# EAGLE design Adapter-TenX-Resistors (EAGLE 7.7.0)
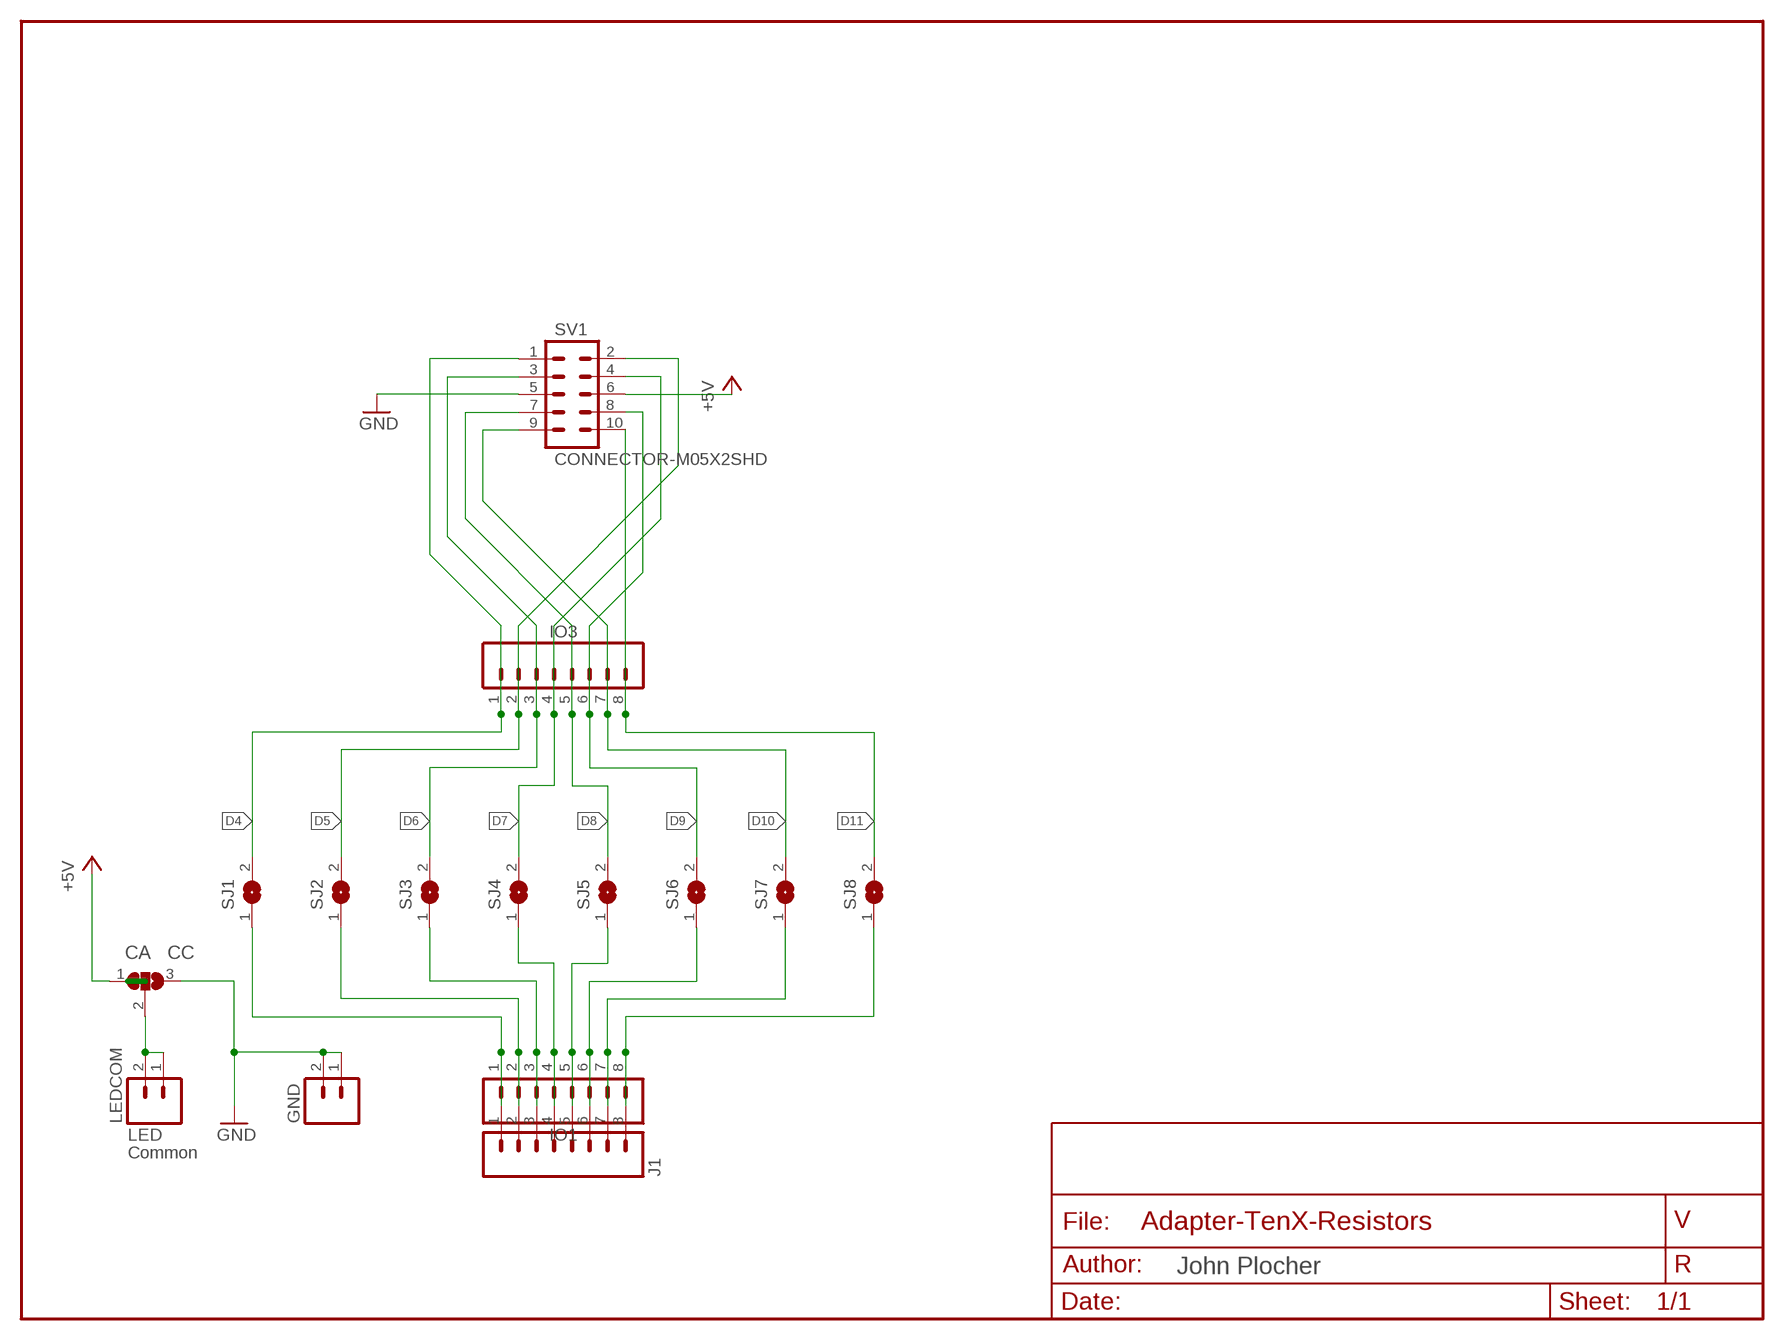
[diagram p0: schematic, sheet 1]

## Parts
GND  M02POLAR_LOCK  [MOLEX-1X2_LOCK]
IO1  M081X08  [1X08]
IO3  M081X08  [1X08]
J1  CONNECTOR-M08LOCK_LONGPADS  [1X08_LOCK_LONGPADS]
LEDCOM  M02POLAR_LOCK  [MOLEX-1X2_LOCK]
P1  CA CC  PAD-SOLDERJUMPER-2WAYT  [3P-SMD-2X4.8]
SJ1  SJ  [SJ]
SJ2  SJ  [SJ]
SJ3  SJ  [SJ]
SJ4  SJ  [SJ]
SJ5  SJ  [SJ]
SJ6  SJ  [SJ]
SJ7  SJ  [SJ]
SJ8  SJ  [SJ]
SV1  CONNECTOR-M05X2SHD  [2X5-SHROUDED]

## Nets
+5V: P1.1 SV1.6
D4: IO3.1 SJ1.2 SV1.1
D5: IO3.2 SJ2.2 SV1.2
D6: IO3.3 SJ3.2 SV1.3
D7: IO3.4 SJ4.2 SV1.4
D8: IO3.5 SJ5.2 SV1.7
D9: IO3.6 SJ6.2 SV1.8
D10: IO3.7 SJ7.2 SV1.9
D11: IO3.8 SJ8.2 SV1.10
GND: GND.1 GND.2 P1.3 SV1.5
N$9: IO1.1 J1.1 SJ1.1
N$10: IO1.2 J1.2 SJ2.1
N$11: IO1.3 J1.3 SJ3.1
N$12: IO1.4 J1.4 SJ4.1
N$13: IO1.5 J1.5 SJ5.1
N$14: IO1.6 J1.6 SJ6.1
N$15: IO1.7 J1.7 SJ7.1
N$16: IO1.8 J1.8 SJ8.1
N$45: LEDCOM.1 LEDCOM.2 P1.2

## Notes on the sheet
- LED
- Common

## Library data of the parts
GND LEDCOM = SparkFun:M02: Header 2 Standard 2-pin 0.1" header. Use with straight break away headers (SKU : PRT-00116), right angle break away headers (PRT-00553), swiss pins (PRT-00743), machine pins (PRT-00117), and female headers (PRT-00115). Molex polarized connector foot print use with SKU : PRT-08233 with associated crimp pins and housings.
IO1 IO3 = SparkFun:M08: Header 8 Standard 8-pin 0.1" header. Use with straight break away headers (SKU : PRT-00116), right angle break away headers (PRT-00553), swiss pins (PRT-00743), machine pins (PRT-00117), and female headers (PRT-00115).
J1 = SPCoast:CONNECTOR-M08: Header 8 Standard 8-pin 0.1" header. Use with straight break away headers (SKU : PRT-00116), right angle break away headers (PRT-00553), swiss pins (PRT-00743), machine pins (PRT-00117), and female headers (PRT-00115).
P1 = Discreter:PAD-SOLDERJUMPER-2WAY: Solder Jumper 2 way solder jumper
SJ1-SJ8 = jumper:SJ: SMD solder JUMPER
SV1 = SPCoast:CONNECTOR-M05X2: Header 5x2 Standard 10-pin dual row 0.1" header. Commonly used with AVR-ISP. Use with Spark Fun Electronics SKU: PRT-00778

## Board
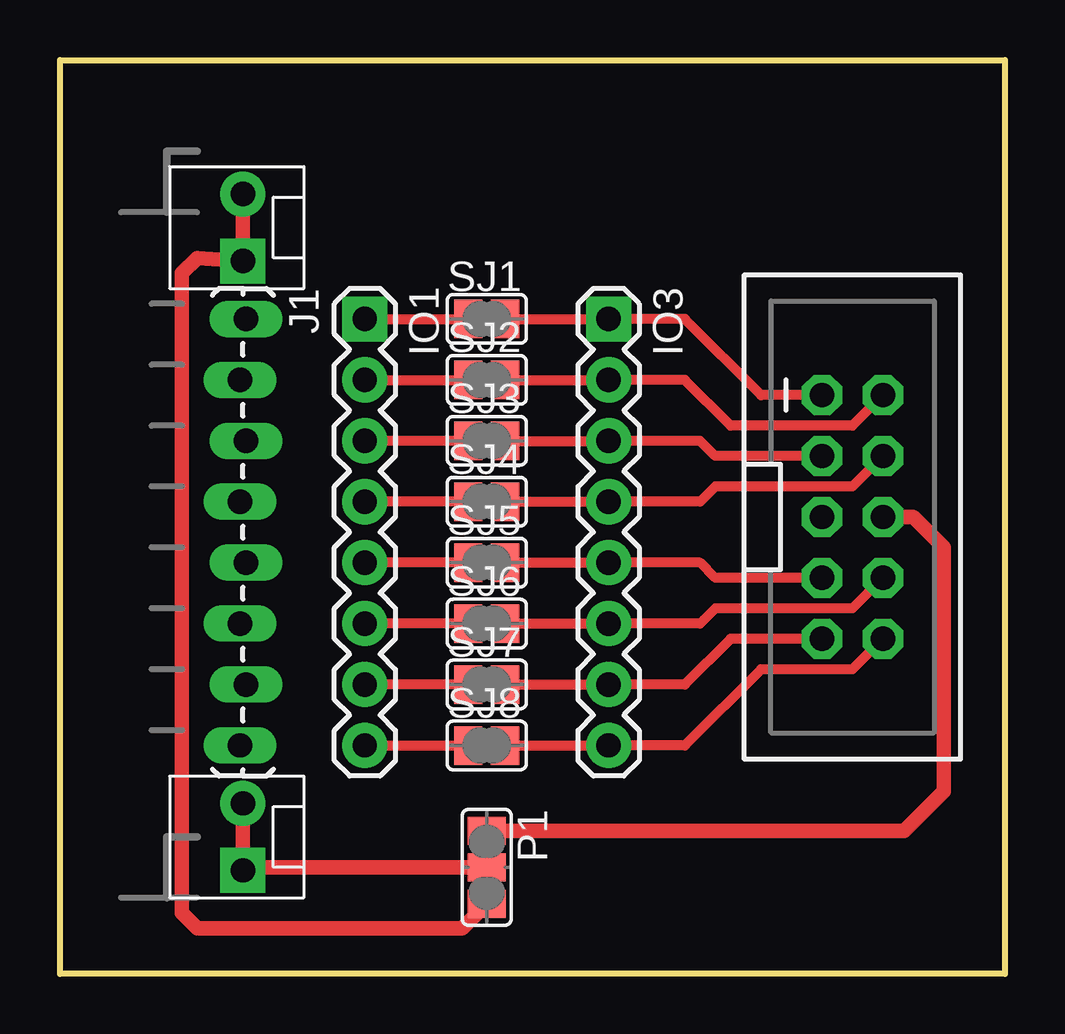
[diagram p1: board, top side]
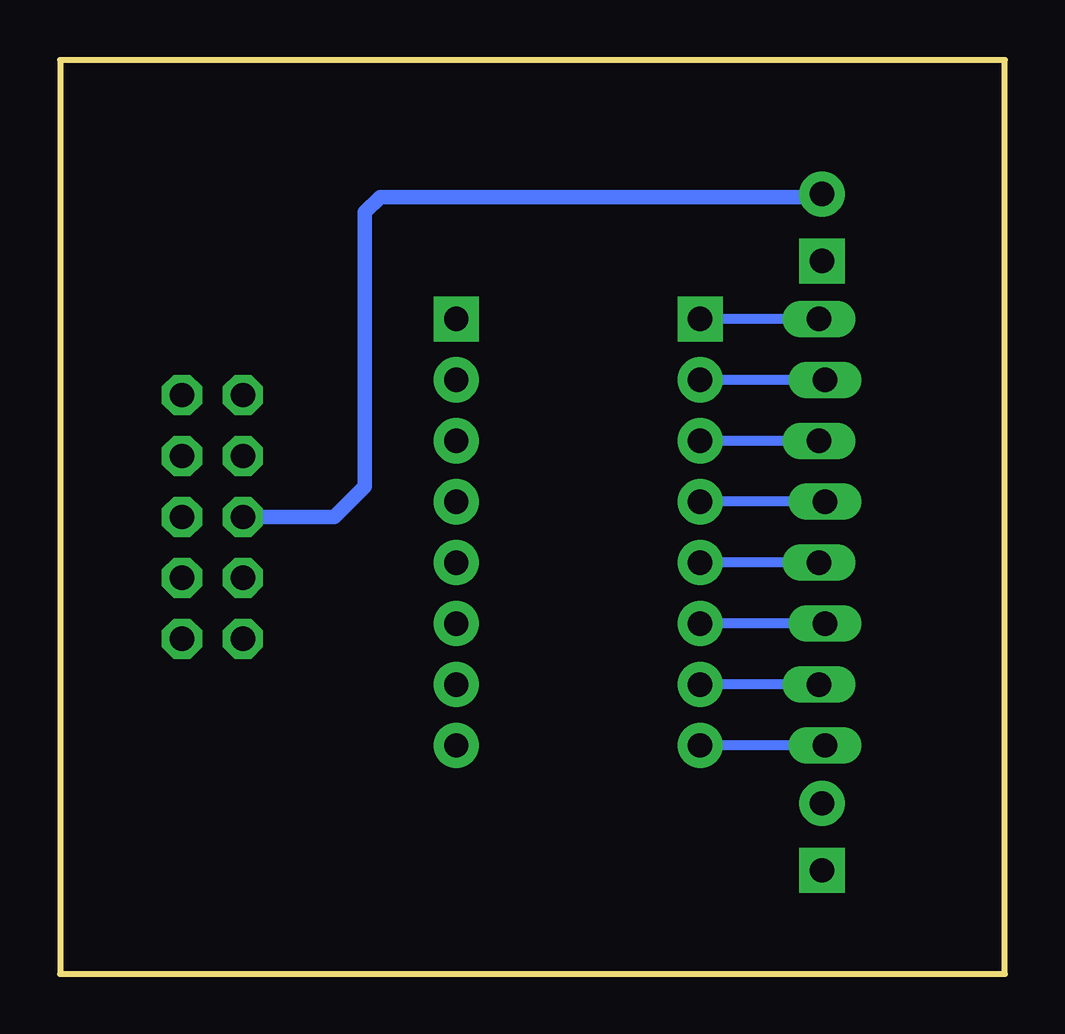
[diagram p2: board, bottom side, seen from below]

Size 39.37 x 38.1 mm. Coordinates in mm from the lower left corner, seen from the top.
Outline: 0,0 0,38.1 39.37,38.1 39.37,0 0,0
Copper layers (1*16): Top 0.035mm / dielectric 1.5mm / Bottom 0.035mm
Design rules "default": minimum track width 10mil, minimum drill 0.6mm, track to track 8mil, track to pad 8mil, pad to pad 8mil, via to via 8mil, smd to smd 8mil, copper to edge 40mil, drill to drill 8mil, minimum pad ring 10mil, minimum via ring 8mil, stop-mask expansion 4mil, vias tented up to drill 0mil, thermal gap 10mil

### Footprints (pad centres in the part's own frame; a part is rotated, then mirrored left to right if it is on the bottom)
MOLEX-1X2_LOCK = drill 1.016 pad 1.88 square: 1 -0.127,0 | drill 1.016 pad 1.88: 2 2.667,0
1X08 = drill 1.016 pad 1.88 square: 1 0,0 | drill 1.016 pad 1.88: 2 2.54,0; 3 5.08,0; 4 7.62,0; 5 10.16,0; 6 12.7,0; 7 15.24,0; 8 17.78,0
1X08_LOCK_LONGPADS = drill 1.016 long: 1 0,0.127; 2 2.54,-0.127; 3 5.08,0.127; 4 7.62,-0.127; 5 10.16,0.127; 6 12.7,-0.127; 7 15.24,0.127; 8 17.78,-0.127
3P-SMD-2X4.8 = smd 1.168 x 1.6: 1 -1.524,0; 2 0,0; 3 1.524,0
SJ = smd 1.168 x 1.6: 1 -0.762,0; 2 0.762,0
2X5-SHROUDED = drill 1.016 pad 1.676 octagon: 1 -1.27,5.08; 2 1.27,5.08; 3 -1.27,2.54; 4 1.27,2.54; 5 -1.27,0; 6 1.27,0; 7 -1.27,-2.54; 8 1.27,-2.54; 9 -1.27,-5.08; 10 1.27,-5.08

### Placement (x,y rotation side)
GND  7.62,29.84 90 top
IO1  12.7,27.3 270 top
IO3  22.86,27.3 270 top
J1  7.62,27.3 270 top
LEDCOM  7.62,4.45 90 top
P1  17.78,4.45 270 top
SJ1  17.78,27.3 0 top
SJ2  17.78,24.77 0 top
SJ3  17.78,22.23 0 top
SJ4  17.78,19.68 0 top
SJ5  17.78,17.14 0 top
SJ6  17.78,14.61 0 top
SJ7  17.78,12.06 0 top
SJ8  17.78,9.53 0 top
SV1  33.02,19.05 0 top

### Tracks (layer width: path | path; a pad name or v marks a point on that pad's centre or on a via)
+5V
  Top 0.61: P1.1 35.18,5.97 36.83,7.62 36.83,17.78 35.56,19.05 SV1.6
D4
  Top 0.406: SJ1.2 IO3.1 26.04,27.3 29.21,24.13 SV1.1
D5
  Top 0.406: SJ2.2 IO3.2 26.04,24.77 27.94,22.86 33.02,22.86 SV1.2
D6
  Top 0.406: SJ3.2 IO3.3 26.67,22.23 27.3,21.59 SV1.3
D7
  Top 0.406: SJ4.2 IO3.4 26.67,19.68 27.3,20.32 33.02,20.32 SV1.4
D8
  Top 0.406: SJ5.2 IO3.5 26.67,17.14 27.3,16.51 SV1.7
D9
  Top 0.406: SJ6.2 IO3.6 26.67,14.61 27.3,15.24 33.02,15.24 SV1.8
D10
  Top 0.406: SJ7.2 IO3.7 26.04,12.06 27.94,13.97 SV1.9
D11
  Top 0.406: SJ8.2 IO3.8 26.04,9.53 29.21,12.7 33.02,12.7 SV1.10
GND
  Top 0.61: GND.2 GND.1 5.71,29.84 5.08,29.21 5.08,2.54 5.71,1.91 16.76,1.91 P1.3
  Bottom 0.61: SV1.5 27.94,19.05 26.67,20.32 26.67,31.75 26.04,32.38 7.75,32.38 GND.2
N$9
  Top 0.406: IO1.1 SJ1.1
  Bottom 0.406: J1.1 IO1.1
N$10
  Top 0.406: IO1.2 SJ2.1
  Bottom 0.406: J1.2 IO1.2
N$11
  Top 0.406: SJ3.1 IO1.3
  Bottom 0.406: J1.3 IO1.3
N$12
  Top 0.406: SJ4.1 IO1.4
  Bottom 0.406: J1.4 IO1.4
N$13
  Top 0.406: SJ5.1 IO1.5
  Bottom 0.406: J1.5 IO1.5
N$14
  Top 0.406: SJ6.1 IO1.6
  Bottom 0.406: J1.6 IO1.6
N$15
  Top 0.406: SJ7.1 IO1.7
  Bottom 0.406: 7.62,12.06 J1.7 IO1.7
N$16
  Top 0.406: IO1.8 SJ8.1
  Bottom 0.406: J1.8 IO1.8
N$45
  Top 0.61: LEDCOM.2 7.62,4.45 | 7.62,4.45 LEDCOM.1 | P1.2 7.62,4.45

### Text on the board
tDocu: WH-R | GND | v1.0 | MRCS | D1 | D2 | D3 | D4 | D5 | D6 | D7 | D8 | LED | Com | Common / C A